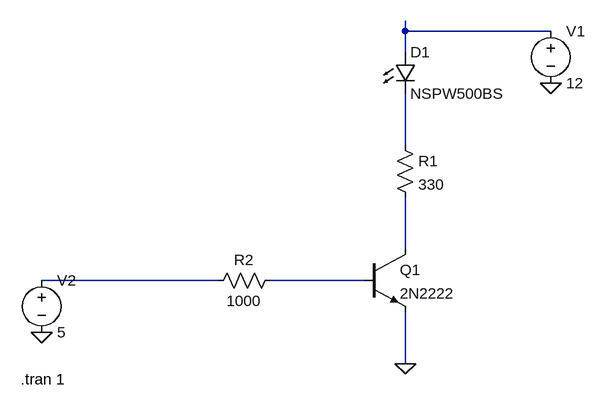
[diagram p0: schematic Draft3w4.asc]
Draft3w4.asc, the LTspice schematic file:
Version 4.1
SHEET 1 880 680
WIRE 256 112 256 96
WIRE 480 112 256 112
WIRE 256 144 256 112
WIRE 256 288 256 208
WIRE 256 448 256 368
WIRE -32 496 -304 496
WIRE 192 496 48 496
WIRE 256 624 256 544
FLAG 256 624 0
FLAG -304 576 0
FLAG 480 192 0
SYMBOL LED 240 144 R0
SYMATTR InstName D1
SYMATTR Value NSPW500BS
SYMBOL res 240 272 R0
SYMATTR InstName R1
SYMATTR Value 330
SYMBOL npn 192 448 R0
SYMATTR InstName Q1
SYMATTR Value 2N2222
SYMBOL res 64 480 R90
WINDOW 0 0 56 VBottom 2
WINDOW 3 32 56 VTop 2
SYMATTR InstName R2
SYMATTR Value 1000
SYMBOL voltage 480 96 R0
SYMATTR InstName V1
SYMATTR Value 12
SYMBOL voltage -304 480 R0
SYMATTR InstName V2
SYMATTR Value 5
TEXT -336 648 Left 2 !.tran 1

The netlist it stands for:
* Draft3w4.asc
D1 N001 N002 NSPW500BS
R1 N002 N003 330
Q1 N003 N005 0 0 2N2222
R2 N005 N004 1000
V1 N001 0 12
V2 N004 0 5
.model D D
.lib standard.dio
.model NPN NPN
.model PNP PNP
.lib standard.bjt
.tran 1
.backanno
.end